# Altium schematic sheet Top_Level.SchDoc
size A
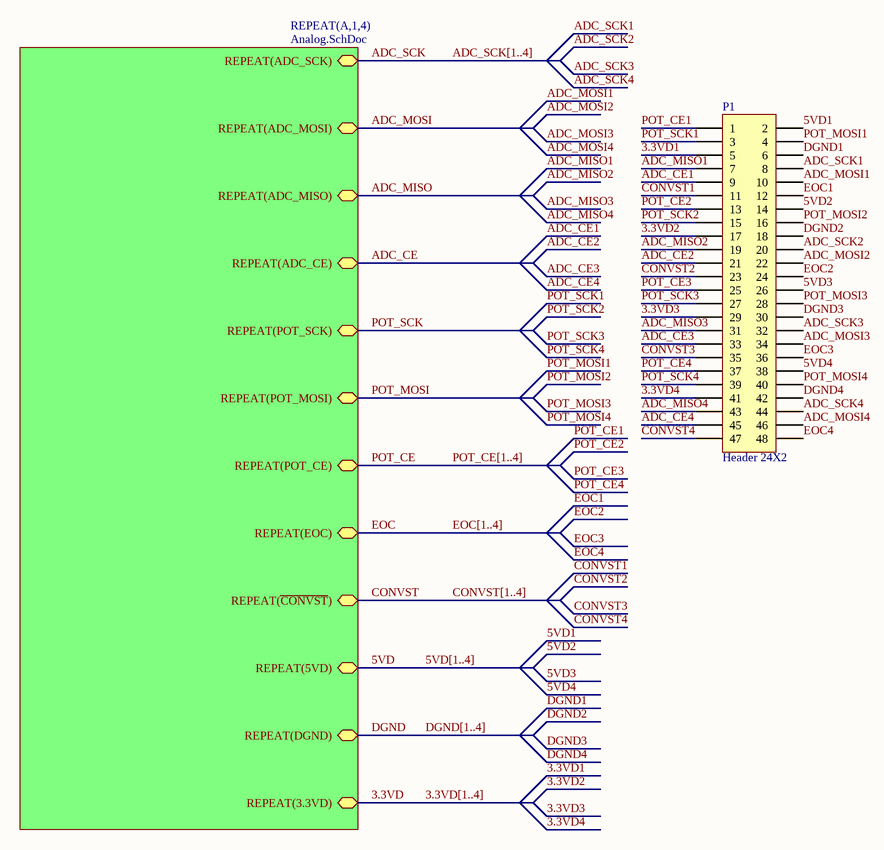
[diagram p0: Top_Level.SchDoc]

## Parts
P1  Header 24X2  [HDR2X24]

## Sub-sheets
REPEAT(A,1,4) = Analog.SchDoc: REPEAT(ADC_SCK) (bidir), REPEAT(ADC_MOSI) (bidir), REPEAT(ADC_MISO) (bidir), REPEAT(ADC_CE) (bidir), REPEAT(~{CONVST}) (bidir), REPEAT(EOC) (bidir), REPEAT(POT_SCK) (bidir), REPEAT(POT_MOSI) (bidir), REPEAT(POT_CE) (bidir), REPEAT(5VD) (bidir), REPEAT(DGND) (bidir), REPEAT(3.3VD) (bidir)

## Nets
3.3VD: sheet REPEAT(A,1,4)/REPEAT(3.3VD)
3.3VD1: P1.5
3.3VD2: P1.17
3.3VD3: P1.29
3.3VD4: P1.41
5VD: sheet REPEAT(A,1,4)/REPEAT(5VD)
5VD1: P1.2
5VD2: P1.14
5VD3: P1.26
5VD4: P1.38
ADC_CE: sheet REPEAT(A,1,4)/REPEAT(ADC_CE)
ADC_CE1: P1.9
ADC_CE2: P1.21
ADC_CE3: P1.33
ADC_CE4: P1.45
ADC_MISO: sheet REPEAT(A,1,4)/REPEAT(ADC_MISO)
ADC_MISO1: P1.7
ADC_MISO2: P1.19
ADC_MISO3: P1.31
ADC_MISO4: P1.43
ADC_MOSI: sheet REPEAT(A,1,4)/REPEAT(ADC_MOSI)
ADC_MOSI1: P1.10
ADC_MOSI2: P1.22
ADC_MOSI3: P1.34
ADC_MOSI4: P1.46
ADC_SCK: sheet REPEAT(A,1,4)/REPEAT(ADC_SCK)
ADC_SCK1: P1.8
ADC_SCK2: P1.20
ADC_SCK3: P1.32
ADC_SCK4: P1.44
CONVST: sheet REPEAT(A,1,4)/REPEAT(~{CONVST})
CONVST1: P1.11
CONVST2: P1.23
CONVST3: P1.35
CONVST4: P1.47
DGND: sheet REPEAT(A,1,4)/REPEAT(DGND)
DGND1: P1.6
DGND2: P1.18
DGND3: P1.30
DGND4: P1.42
EOC: sheet REPEAT(A,1,4)/REPEAT(EOC)
EOC1: P1.12
EOC2: P1.24
EOC3: P1.36
EOC4: P1.48
POT_CE: sheet REPEAT(A,1,4)/REPEAT(POT_CE)
POT_CE1: P1.1
POT_CE2: P1.13
POT_CE3: P1.25
POT_CE4: P1.37
POT_MOSI: sheet REPEAT(A,1,4)/REPEAT(POT_MOSI)
POT_MOSI1: P1.4
POT_MOSI2: P1.16
POT_MOSI3: P1.28
POT_MOSI4: P1.40
POT_SCK: sheet REPEAT(A,1,4)/REPEAT(POT_SCK)
POT_SCK1: P1.3
POT_SCK2: P1.15
POT_SCK3: P1.27
POT_SCK4: P1.39

## Buses and harness runs
bus 3.3VD[1..4]
bus 5VD[1..4]
bus ADC_SCK[1..4]
bus CONVST[1..4]
bus DGND[1..4]
bus EOC[1..4]
bus POT_CE[1..4]

## Library data of the parts
P1 = Header 24X2: Header, 24-Pin, Dual row; LatestRevisionDate: 17-Jul-2002; LatestRevisionNote: Re-released for DXP Platform.; Publisher: Altium Limited; Supplier Part Number 1: 952-1917-ND; Supplier 1: Digi-Key